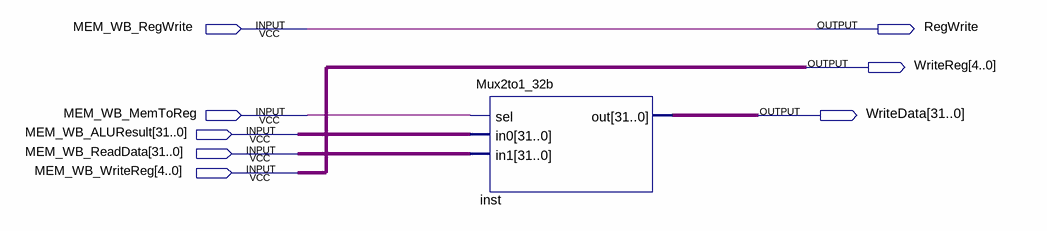
[diagram p0: schematic sheet]
// Quartus schematic WB_STAGE.bdf as structural Verilog: 1 symbols, 8 pins
module WB_STAGE (
  input  MEM_WB_RegWrite,
  input  MEM_WB_MemToReg,
  input  [31:0] MEM_WB_ALUResult,
  input  [31:0] MEM_WB_ReadData,
  input  [4:0] MEM_WB_WriteReg,
  output RegWrite,
  output [4:0] WriteReg,
  output [31:0] WriteData
);

  Mux2to1_32b inst (.sel(MEM_WB_MemToReg), .in0(MEM_WB_ALUResult), .in1(MEM_WB_ReadData), .out(WriteData));

  assign RegWrite = MEM_WB_RegWrite;
  assign WriteReg = MEM_WB_WriteReg;
endmodule
